# Altium schematic sheet Half-Bridge.SchDoc
size A4; SheetNumber: 2; SheetTotal: 3
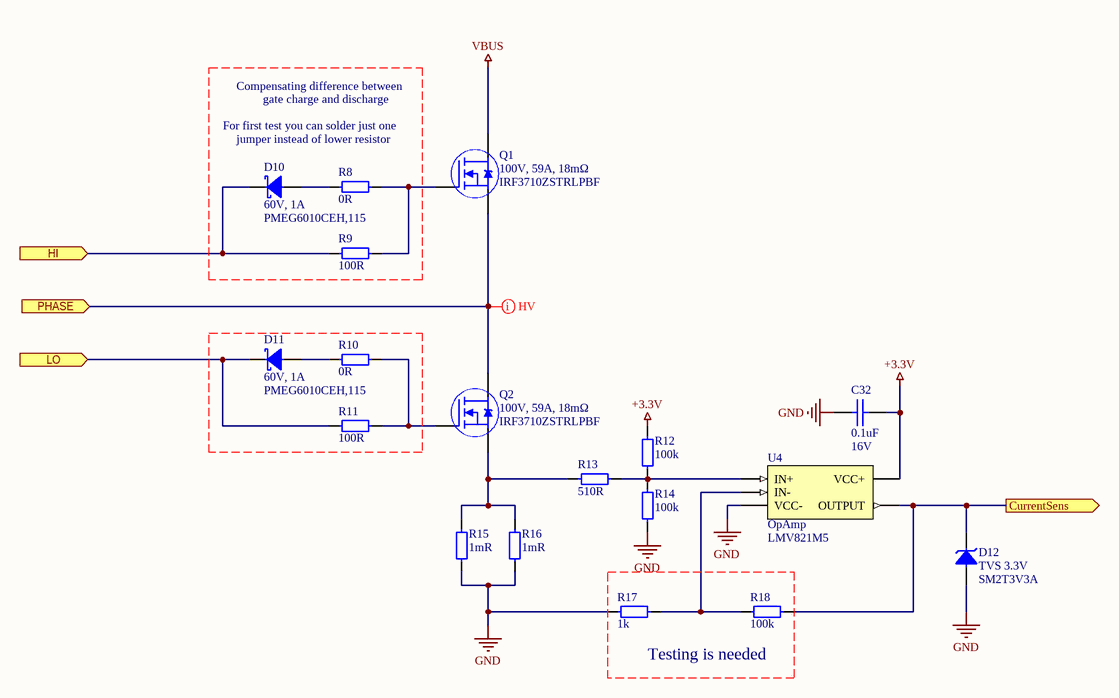
[diagram p0: Half-Bridge.SchDoc]

## Parts
C32  0.1uF  Voltage: 16V  [0603 Capicator]
D10  60V, 1A  Part Number: PMEG6010CEH,115  [SOD-123FL]
D11  60V, 1A  Part Number: PMEG6010CEH,115  [SOD-123FL]
D12  TVS 3.3V  Part Number: SM2T3V3A  [DO-216AA]
Q1  100V, 59A, 18mΩ  Part Number: IRF3710ZSTRLPBF  [D2-PAK (TO-262)]
Q2  100V, 59A, 18mΩ  Part Number: IRF3710ZSTRLPBF  [D2-PAK (TO-262)]
R8  0R  [0603 Resistor]
R9  100R  [0603 Resistor]
R10  0R  [0603 Resistor]
R11  100R  [0603 Resistor]
R12  100k  [0603 Resistor]
R13  510R  [0603 Resistor]
R14  100k  [0603 Resistor]
R15  1mR  [2512 Resistor]
R16  1mR  [2512 Resistor]
R17  1k  [0603 Resistor]
R18  100k  [0603 Resistor]
U4  OpAmp  Part Number: LMV821M5  [SOT-23-5]

## Ports
CurrentSens (out, see BLDC_Drive[7A]), HI (in, see BLDC_Drive[7A]), LO (in, see BLDC_Drive[7A]), PHASE (in, see BLDC_Drive[7A])

## Nets
+3.3V: C32.1 R12.2 U4.5(VCC+)
GND: C32.2 D12.1 R14.1 R15.1 R16.1 R17.1 U4.2(VCC-)
VBUS: Q1.2(Drain)
CurrentSens: D12.2 R18.2 U4.4(OUTPUT) ; port CurrentSens
HI: D10.2 R9.1 ; port HI
LO: D11.2 R11.1 ; port LO
PHASE: Q1.3(Source) Q2.2(Drain) ; port PHASE
NetD10_1: D10.1 R8.1
NetD11_1: D11.1 R10.1
NetQ1_1: Q1.1(Gate) R8.2 R9.2
NetQ2_1: Q2.1(Gate) R10.2 R11.2
NetQ2_3: Q2.3(Source) R13.1 R15.2 R16.2
NetR12_1: R12.1 R13.2 R14.2 U4.1(IN+)
NetR17_2: R17.2 R18.1 U4.3(IN-)

## Layout directives
net class HV: PHASE

## Notes on the sheet
- (near Q1) For first test you can solder just one
- Compensating difference between
- jumper instead of lower resistor
- gate charge and discharge
- Testing is needed

## Library data of the parts
C32 = Cap 0.1uF (0603): 0.1uF X7R 16V 10% 0603; Manufacturer: Murata Manufacturing; Part Number: GRM188R71C104KA01D; Type: Capacitor; ComponentLink1Description: Chip&Dip; ComponentLink1URL: https://www.chipdip.ru/product/grm188r71c104ka01d
D10 D11 = Diode Schottky 60V (SOD-123FL): Manufacturer: Nexperia; Type: Diode; ComponentLink1Description: DataSheet; ComponentLink1URL: https://static.chipdip.ru/lib/614/DOC011614194.pdf; ComponentLink2Description: Chip&Dip; ComponentLink2URL: https://www.chipdip.ru/product/pmeg6010ceh.115
D12 = TVS Diode 3.3V [SM2T]: High peak pulse power: 200 W (10/1000 μs); Manufacturer: STMicroelectronics; Type: Diode; ComponentLink1Description: DataSheet; ComponentLink1URL: https://www.st.com/resource/en/datasheet/sm2t3v3a.pdf; ComponentLink2Description: Chip&Dip; ComponentLink2URL: https://www.chipdip.ru/product0/8283670575
Q1 Q2 = MOSFET-N [IRF]: Power MOSFET utilizes the latest processing techniques to achieve extremely low on-resistance per silicon area; Manufacturer: Infineon; Type: Transistor; ComponentLink1Description: DataSheet; ComponentLink1URL: https://static.chipdip.ru/lib/300/DOC000300442.pdf; ComponentLink2Description: Chip&Dip; ComponentLink2URL: https://www.chipdip.ru/product/irf3710zspbf
R8 R10 = Res 0R (0603): 0.1W 0603 0R, 5%; Part Number: RC0603JR-070RL; Manufacturer: Taiwan; Type: Resistor; ComponentLink1Description: Chip&Dip; ComponentLink1URL: https://www.chipdip.ru/product0/9000070541
R9 R11 = Res 100R (0603): 0.1W 0603 100R, 1%; Part Number: RC0603FR-07100RL; Manufacturer: Taiwan; Type: Resistor; ComponentLink1Description: Chip&Dip; ComponentLink1URL: https://www.chipdip.ru/product0/9000079616
R12 R14 R18 = Res 100k (0603): 0.1W 0603 100k, 1%; Part Number: RC0603FR-07100KL; Manufacturer: Taiwan; Type: Resistor; ComponentLink1Description: Chip&Dip; ComponentLink1URL: https://www.chipdip.ru/product0/9000079760
R13 = Res 510R (0603): 0.1W 0603 510R, 1%; Part Number: RC0603FR-07510RL; Manufacturer: Taiwan; Type: Resistor; ComponentLink1Description: Chip&Dip; ComponentLink1URL: https://www.chipdip.ru/product0/9000079669
R15 R16 = Res Precise 1mR (2512): Current Shunt, 1W 2512 1mR 1%; Part Number: WSL25121L000FEA; Manufacturer: Vishay; Type: Resistor; ComponentLink1Description: Electronshik; ComponentLink1URL: https://www.electronshik.ru/item/VISHAY/WSL25121L000FEA
R17 = Res 1k (0603): 0.1W 0603 1k, 1%; Part Number: RC0603FR-071KL; Manufacturer: Taiwan; Type: Resistor; ComponentLink1Description: Chip&Dip; ComponentLink1URL: https://www.chipdip.ru/product0/9000079676
U4 = OpAmp [LMV821]: A single low power precision Operational Amplifier intended for use in a wide range of applications; Manufacturer: Texas Instruments; ComponentLink1Description: DataSheet; ComponentLink1URL: https://static.chipdip.ru/lib/235/DOC000235297.pdf; ComponentLink2Description: Chip&Dip; ComponentLink2URL: https://www.chipdip.ru/product/lmv821m5; Type: IC